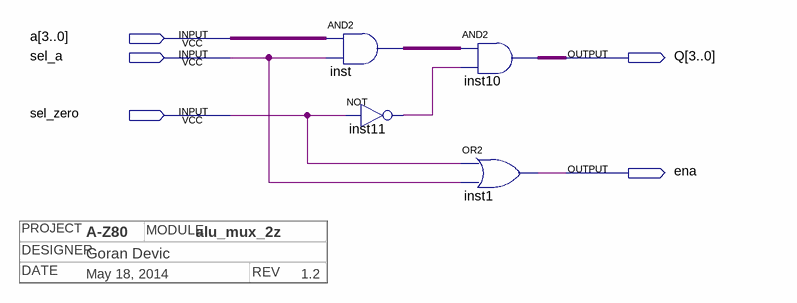
[diagram p0: schematic sheet]
// Quartus schematic alu_mux_2z.bdf as structural Verilog: 4 symbols, 5 pins
// Title block: PROJECT: A-Z80; MODULE: alu_mux_2z; DESIGNER: Goran Devic; DATE: May 18, 2014; REV: 1.2
module alu_mux_2z (
  input  [3:0] a,
  input  sel_a,
  input  sel_zero,
  output [3:0] Q,
  output ena
);

  wire inst11_out;
  wire [3:0] inst_out;

  assign inst_out = a & {4{sel_a}};  // AND2 inst, 4 bits wide
  not inst11 (inst11_out, sel_zero);
  assign Q = inst_out & {4{inst11_out}};  // AND2 inst10, 4 bits wide
  or inst1 (ena, sel_zero, sel_a);
endmodule
